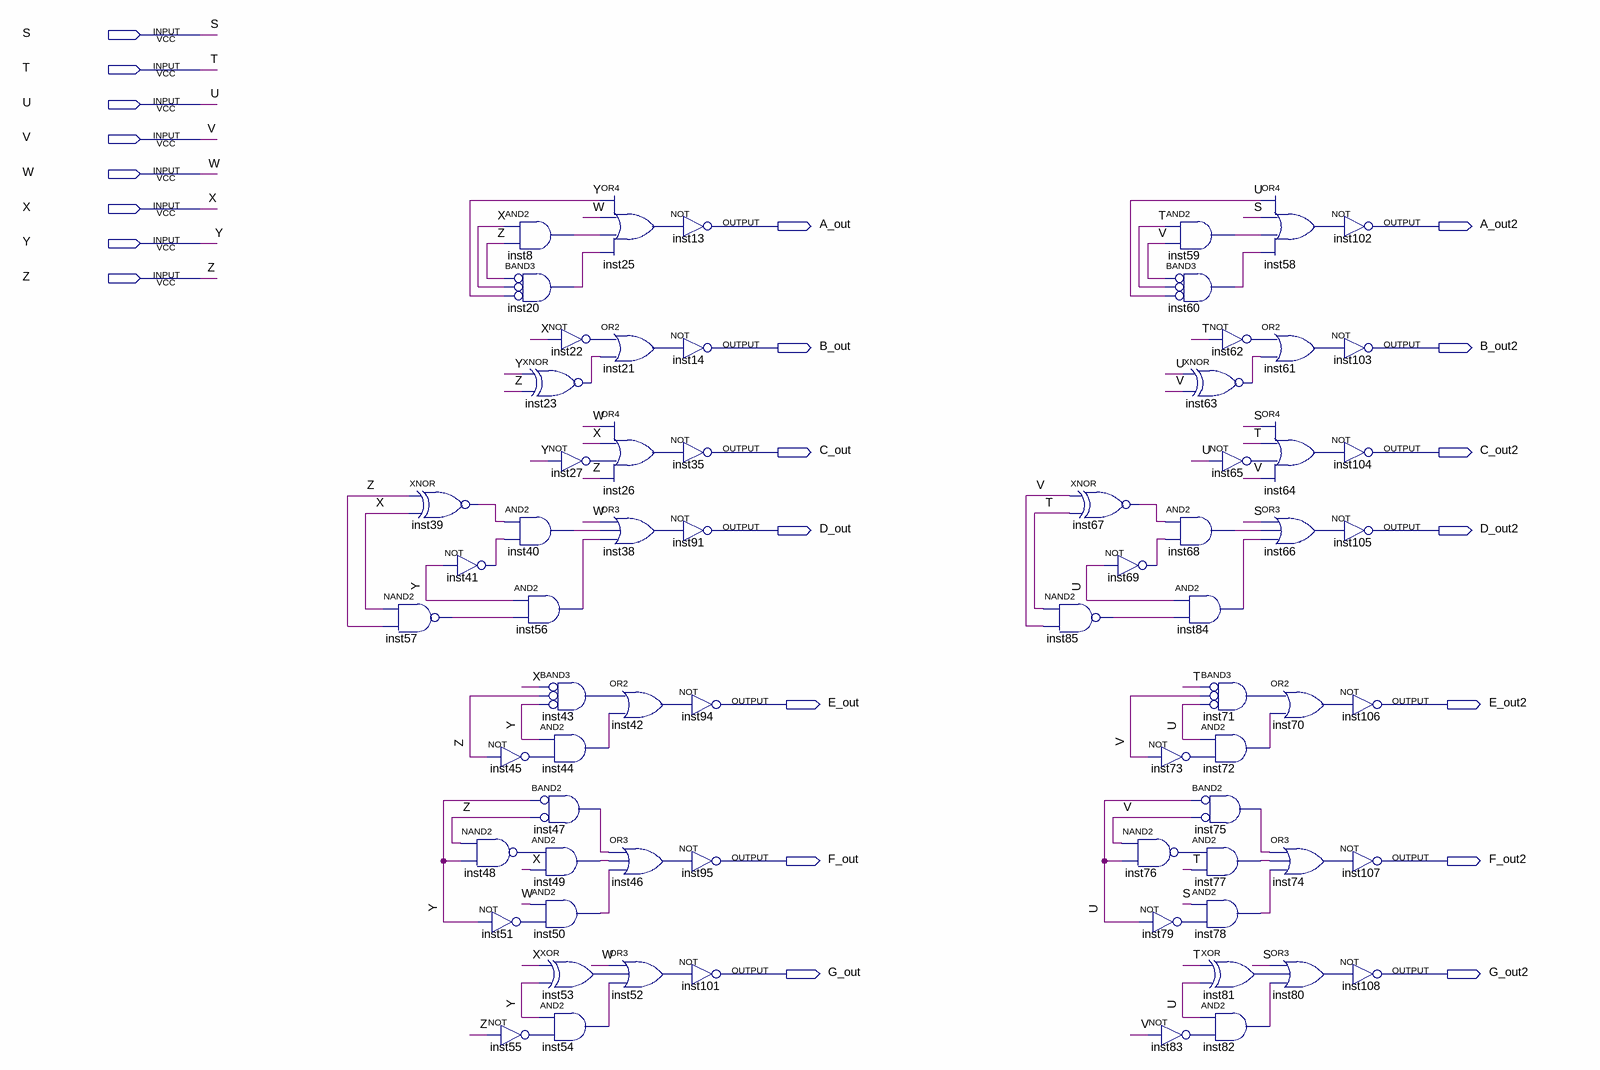
[diagram p0: schematic sheet]
// Quartus schematic BCD_2_7seg.bdf as structural Verilog: 70 symbols, 22 pins
module BCD_2_7seg (
  input  S,
  input  T,
  input  U,
  input  V,
  input  W,
  input  X,
  input  Y,
  input  Z,
  output A_out,
  output A_out2,
  output B_out,
  output B_out2,
  output C_out,
  output C_out2,
  output D_out,
  output D_out2,
  output E_out,
  output E_out2,
  output F_out,
  output F_out2,
  output G_out,
  output G_out2
);

  wire inst8_out, inst20_out, inst21_out, inst22_out, inst23_out, inst25_out, inst26_out, inst27_out,
       inst38_out, inst39_out, inst40_out, inst41_out, inst42_out, inst43_out, inst44_out, inst45_out,
       inst46_out, inst47_out, inst48_out, inst49_out, inst50_out, inst51_out, inst52_out, inst53_out,
       inst54_out, inst55_out, inst56_out, inst57_out, inst58_out, inst59_out, inst60_out, inst61_out,
       inst62_out, inst63_out, inst64_out, inst65_out, inst66_out, inst67_out, inst68_out, inst69_out,
       inst70_out, inst71_out, inst72_out, inst73_out, inst74_out, inst75_out, inst76_out, inst77_out,
       inst78_out, inst79_out, inst80_out, inst81_out, inst82_out, inst83_out, inst84_out, inst85_out;

  xnor inst39 (inst39_out, Z, X);
  nand inst57 (inst57_out, X, Z);
  not inst41 (inst41_out, Y);
  nand inst48 (inst48_out, Z, Y);
  not inst51 (inst51_out, Y);
  and inst8 (inst8_out, X, Z);
  and inst20 (inst20_out, ~Z, ~X, ~Y);  // BAND3
  not inst22 (inst22_out, X);
  xnor inst23 (inst23_out, Y, Z);
  not inst27 (inst27_out, Y);
  and inst40 (inst40_out, inst39_out, inst41_out);
  and inst56 (inst56_out, Y, inst57_out);
  and inst43 (inst43_out, ~X, ~Z, ~Y);  // BAND3
  and inst44 (inst44_out, Y, inst45_out);
  not inst45 (inst45_out, Z);
  and inst47 (inst47_out, ~Y, ~Z);  // BAND2
  and inst49 (inst49_out, inst48_out, X);
  and inst50 (inst50_out, W, inst51_out);
  xor inst53 (inst53_out, X, Y);
  and inst54 (inst54_out, Y, inst55_out);
  not inst55 (inst55_out, Z);
  or inst25 (inst25_out, Y, W, inst8_out, inst20_out);
  or inst21 (inst21_out, inst22_out, inst23_out);
  or inst26 (inst26_out, W, X, inst27_out, Z);
  or inst38 (inst38_out, W, inst40_out, inst56_out);
  or inst42 (inst42_out, inst43_out, inst44_out);
  or inst46 (inst46_out, inst47_out, inst49_out, inst50_out);
  or inst52 (inst52_out, W, inst53_out, inst54_out);
  not inst13 (A_out, inst25_out);
  not inst14 (B_out, inst21_out);
  not inst35 (C_out, inst26_out);
  not inst91 (D_out, inst38_out);
  not inst94 (E_out, inst42_out);
  not inst95 (F_out, inst46_out);
  not inst101 (G_out, inst52_out);
  xnor inst67 (inst67_out, V, T);
  not inst69 (inst69_out, U);
  nand inst85 (inst85_out, T, V);
  and inst59 (inst59_out, T, V);
  and inst60 (inst60_out, ~V, ~T, ~U);  // BAND3
  and inst68 (inst68_out, inst67_out, inst69_out);
  and inst84 (inst84_out, U, inst85_out);
  not inst73 (inst73_out, V);
  nand inst76 (inst76_out, V, U);
  not inst79 (inst79_out, U);
  not inst83 (inst83_out, V);
  not inst62 (inst62_out, T);
  xnor inst63 (inst63_out, U, V);
  not inst65 (inst65_out, U);
  and inst71 (inst71_out, ~T, ~V, ~U);  // BAND3
  and inst72 (inst72_out, U, inst73_out);
  and inst75 (inst75_out, ~U, ~V);  // BAND2
  and inst77 (inst77_out, inst76_out, T);
  and inst78 (inst78_out, S, inst79_out);
  xor inst81 (inst81_out, T, U);
  and inst82 (inst82_out, U, inst83_out);
  or inst58 (inst58_out, U, S, inst59_out, inst60_out);
  or inst61 (inst61_out, inst62_out, inst63_out);
  or inst64 (inst64_out, S, T, inst65_out, V);
  or inst66 (inst66_out, S, inst68_out, inst84_out);
  or inst70 (inst70_out, inst71_out, inst72_out);
  or inst74 (inst74_out, inst75_out, inst77_out, inst78_out);
  or inst80 (inst80_out, S, inst81_out, inst82_out);
  not inst102 (A_out2, inst58_out);
  not inst103 (B_out2, inst61_out);
  not inst104 (C_out2, inst64_out);
  not inst105 (D_out2, inst66_out);
  not inst106 (E_out2, inst70_out);
  not inst107 (F_out2, inst74_out);
  not inst108 (G_out2, inst80_out);
endmodule
